# EasyEDA schematic RC-7606M-LED.json

## Sheets
1 Sheet_2: TITLE: Sheet_1; REV: 1.0; Date: 2022-10-01; Sheet: 1/1; Drawn By: kejinlu; Company: Your Company
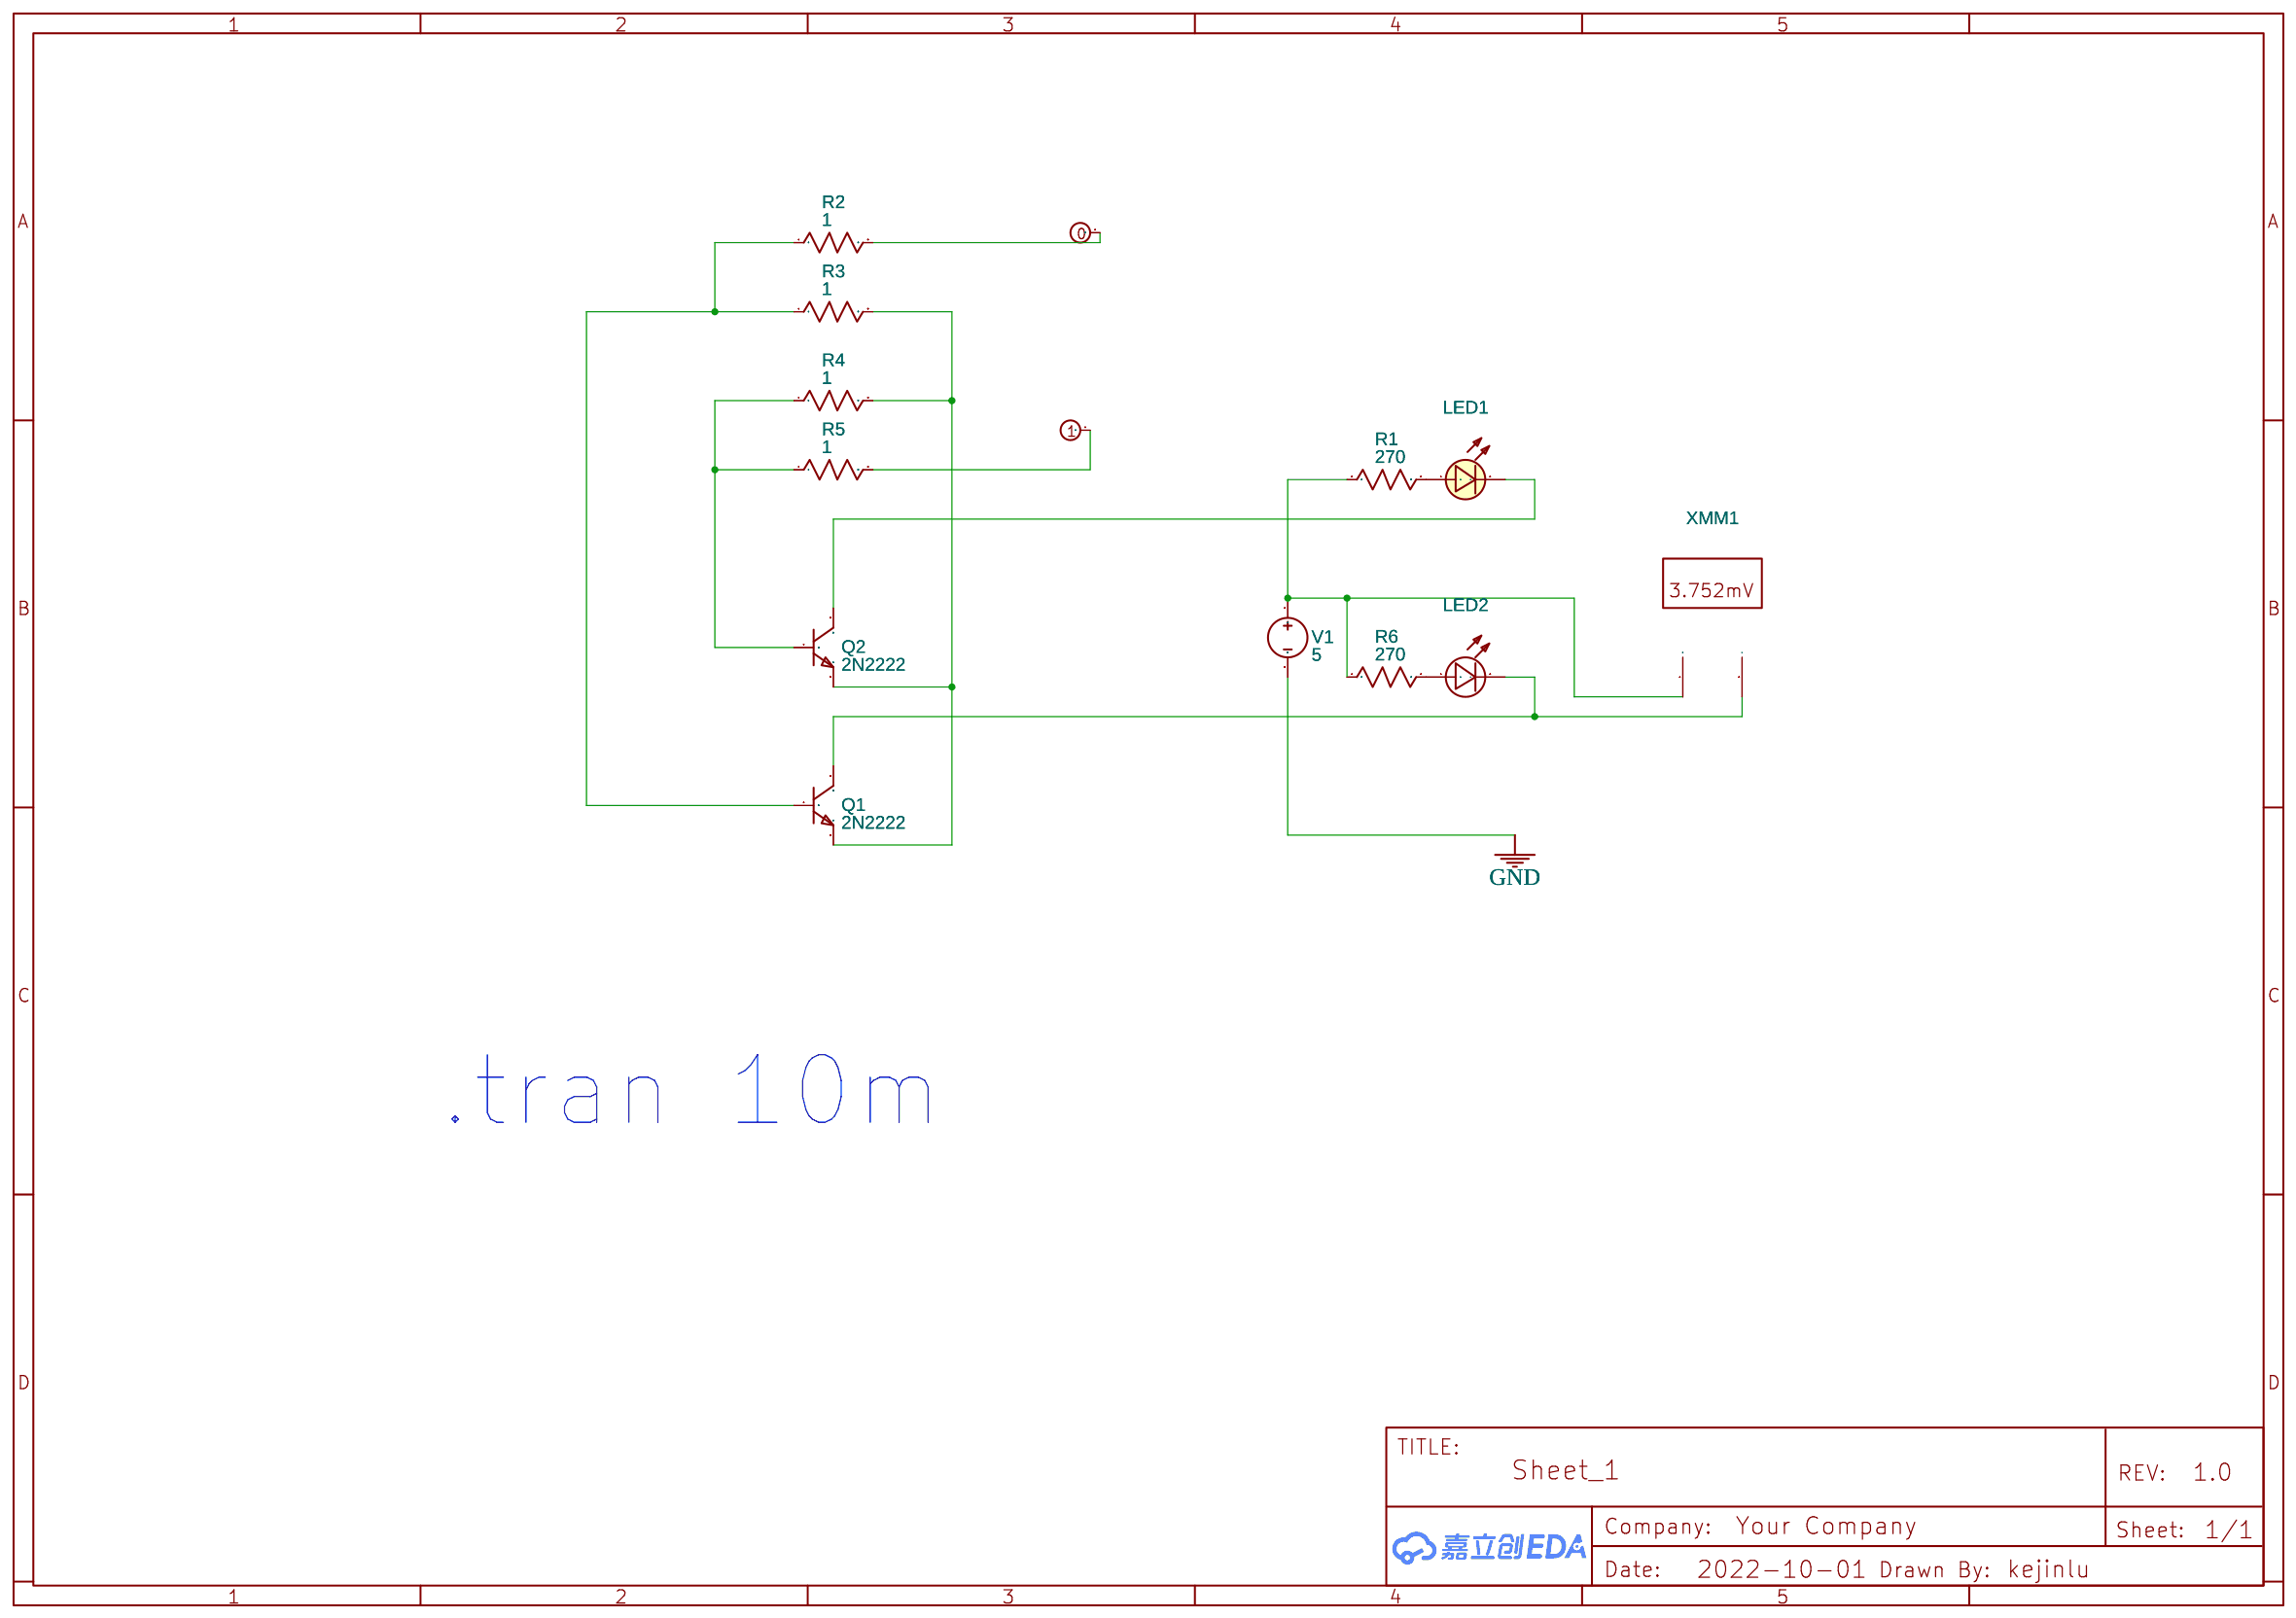
[diagram p0: Sheet_2]
2 Sheet_1: TITLE: Sheet_2; Date: 2022-10-02
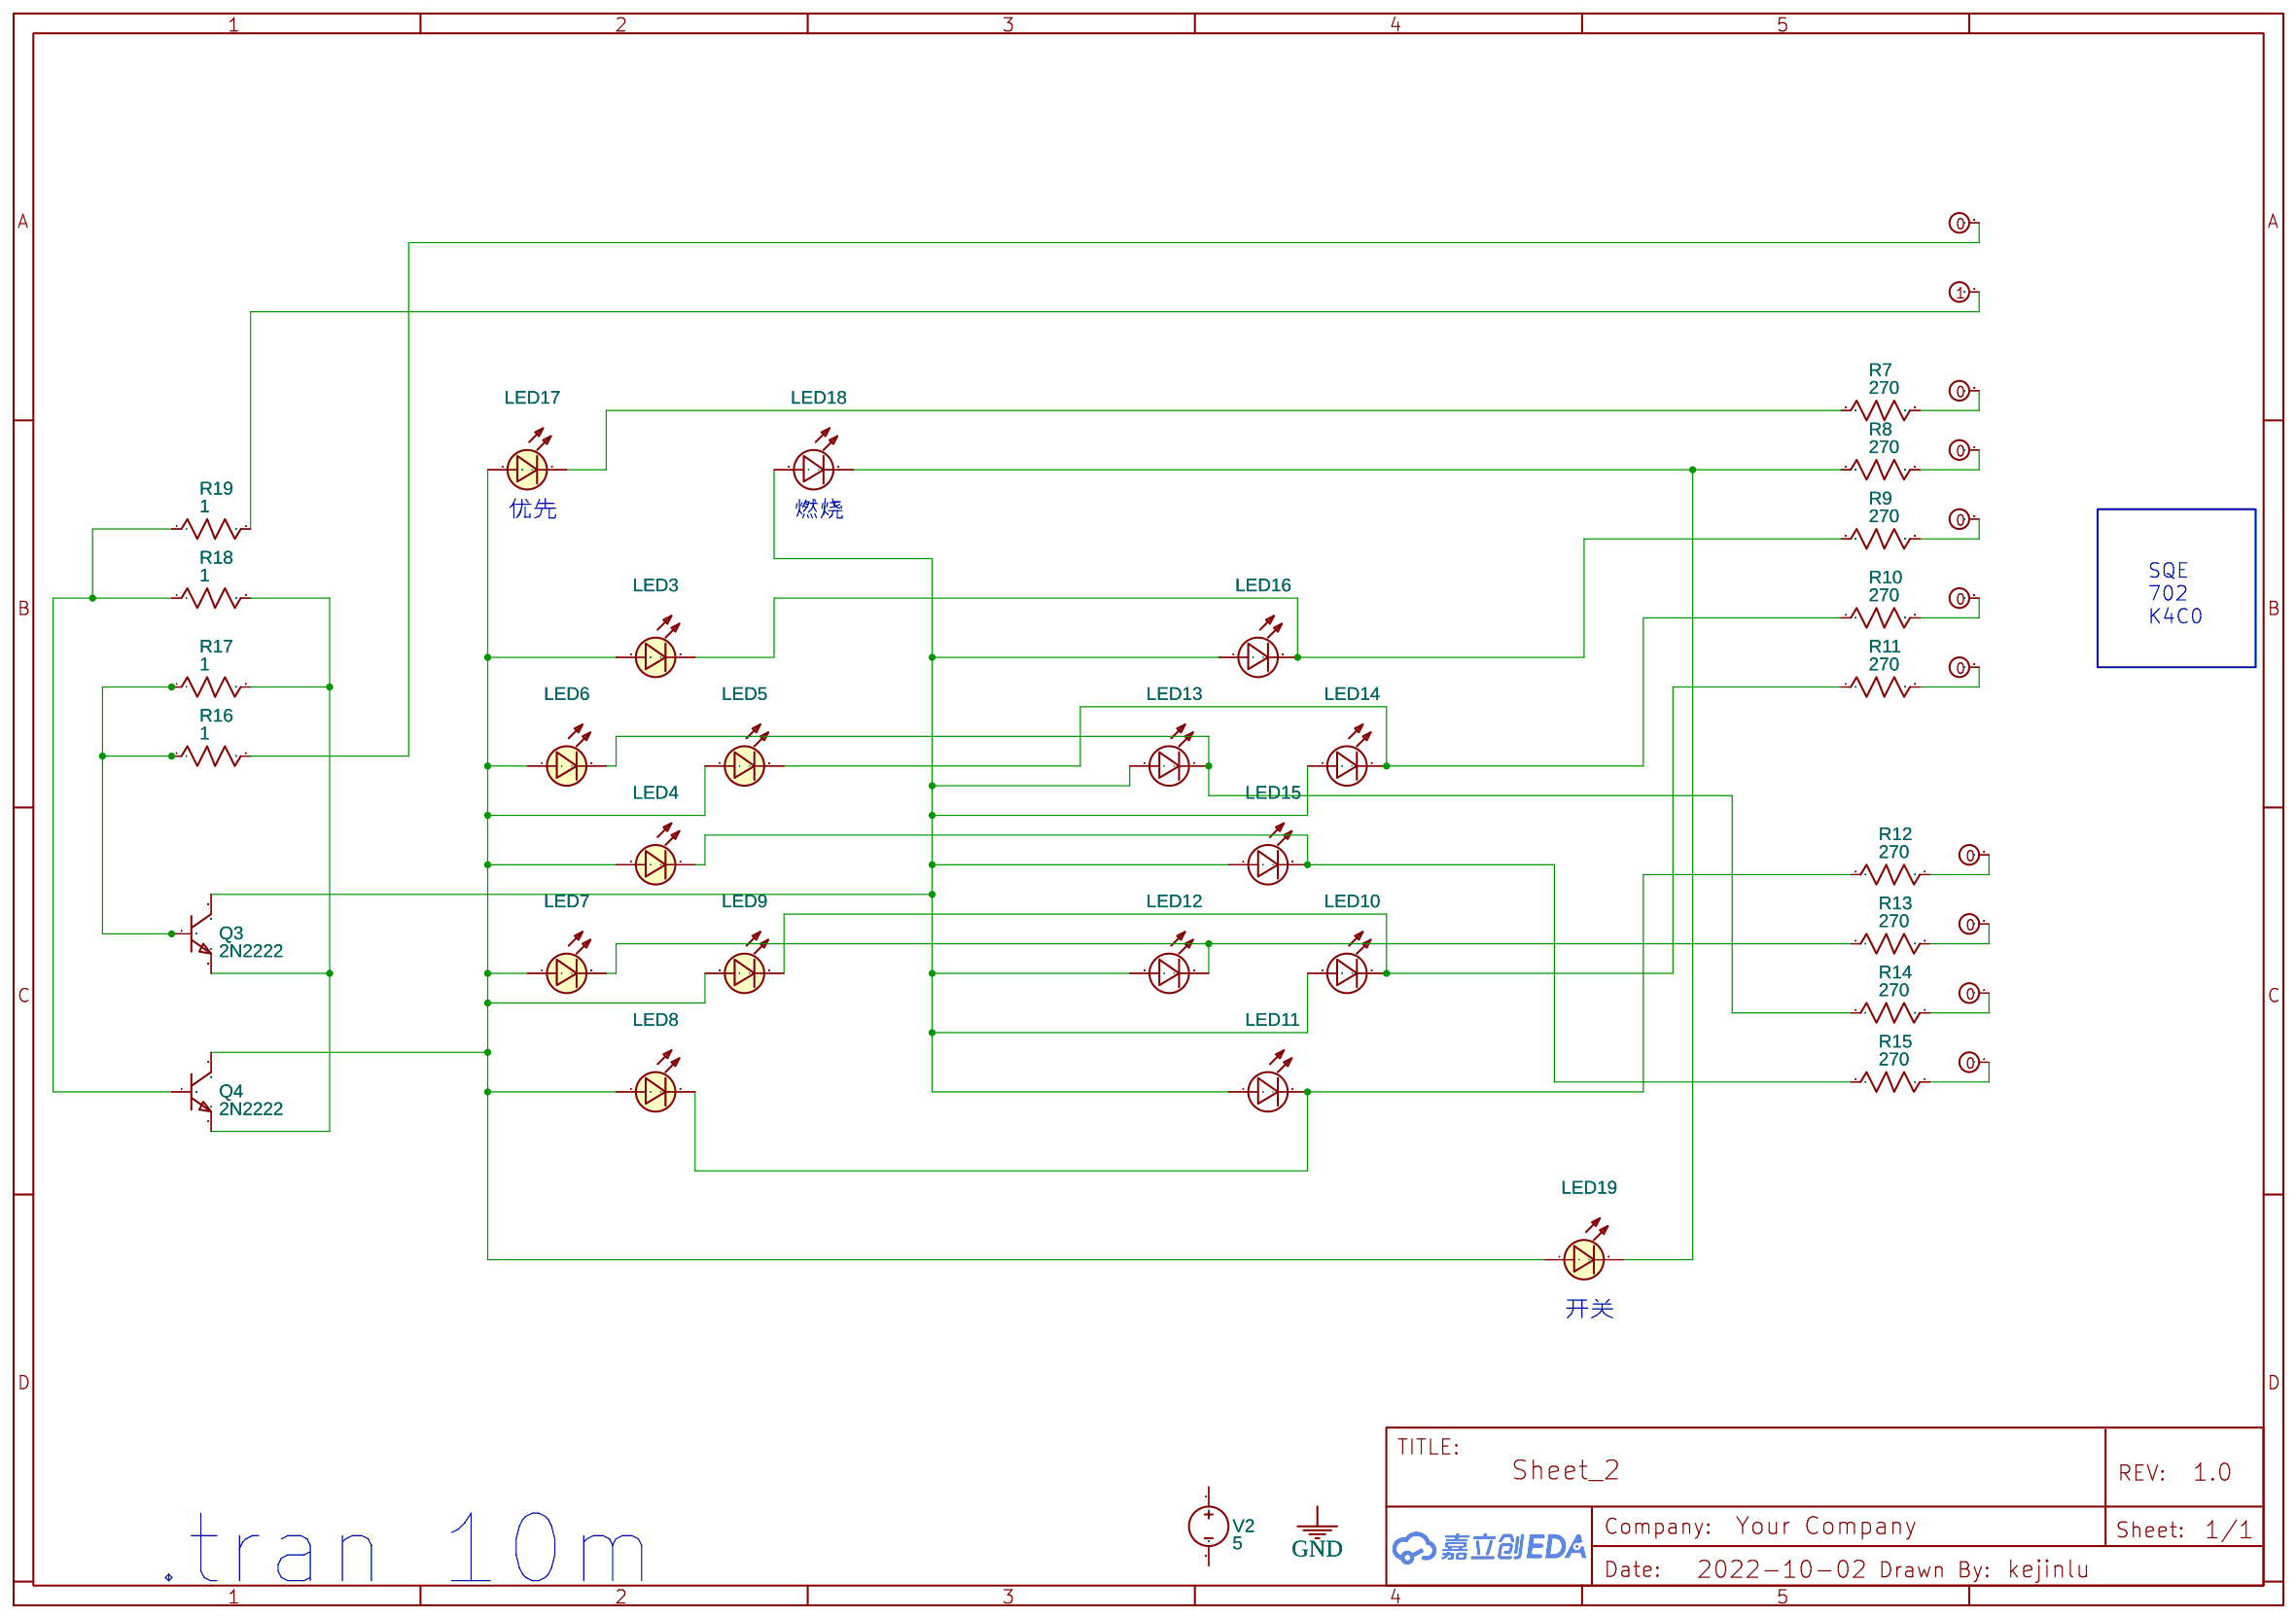
[diagram p1: Sheet_1]

## Parts
sheet Sheet_1
LED3  LED
LED4  LED
LED5  LED
LED6  LED
LED7  LED
LED8  LED
LED9  LED
LED10  LED
LED11  LED
LED12  LED
LED13  LED
LED14  LED
LED15  LED
LED16  LED
LED17  LED
LED18  LED
LED19  LED
Q3  2N2222
Q4  2N2222
R7  270  [AXIAL-0.3]
R8  270  [AXIAL-0.3]
R9  270  [AXIAL-0.3]
R10  270  [AXIAL-0.3]
R11  270  [AXIAL-0.3]
R12  270  [AXIAL-0.3]
R13  270  [AXIAL-0.3]
R14  270  [AXIAL-0.3]
R15  270  [AXIAL-0.3]
R16  1  [AXIAL-0.3]
R17  1  [AXIAL-0.3]
R18  1  [AXIAL-0.3]
R19  1  [AXIAL-0.3]
U3  Logicstate1
U4  Logicstate1
U5  Logicstate1
U6  Logicstate1
U7  Logicstate1
U8  Logicstate1
U9  Logicstate1
U10  Logicstate1
U11  Logicstate1
U12  Logicstate1
U13  Logicstate1
V2  5  [HDR1X2]
sheet Sheet_2
LED1  LED
LED2  LED
Q1  2N2222
Q2  2N2222
R1  270  [AXIAL-0.3]
R2  1  [AXIAL-0.3]
R3  1  [AXIAL-0.3]
R4  1  [AXIAL-0.3]
R5  1  [AXIAL-0.3]
R6  270  [AXIAL-0.3]
U1  Logicstate1
U2  Logicstate1
V1  5  [HDR1X2]
XMM1  Multimeter

## Library data of the parts
LED1-LED19 = LED: catid: 20; Contributor: 仿真库绘制; Color: Red; NameDisplay: 0
Q1-Q4 = 2N2222: Contributor: EasyEDA
R1-R19 = Resistor_US: Resistance: 1k; Contributor: EasyEDA; Supplier: YUJING
U1 U3 U5-U13 = LOGICSTATE: Contributor: EasyEDA; NameDisplay: 0; 值: 1; PreDisplay: 0; State: low
U2 U4 = LOGICSTATE: Contributor: EasyEDA; NameDisplay: 0; 值: 1; PreDisplay: 0; State: high
V1 V2 = VDC: Contributor: EasyEDA; sim: true
XMM1 = MULTIMETER: Supplier: LCSC; Multimeter Type: Volt; Power Type: AC; Voltmeter resistance: 10μ; Ammeter resistance: 1G; NameDisplay: 0; Contributor: EasyEDA; sim: true

## Nets
GND: V1.2
Net-(LED1-1): LED1.1(+) R1.2
Net-(LED1-2): LED1.2(-) Q2.3(C)
Net-(LED2-1): LED2.1(+) R6.2
Net-(LED2-2): LED2.2(-) Q1.3(C) XMM1.2(I)
Net-(LED3-1): LED3.1(+) LED4.1(+) LED5.1(+) LED6.1(+) LED7.1(+) LED8.1(+) LED9.1(+) LED17.1(+) LED19.1(+) Q4.3(C)
Net-(LED3-2): LED3.2(-) LED16.2(-) R9.1
Net-(LED4-2): LED4.2(-) LED15.2(-) R15.1
Net-(LED5-2): LED5.2(-) LED14.2(-) R10.1
Net-(LED6-2): LED6.2(-) LED13.2(-) R14.1
Net-(LED7-2): LED7.2(-) LED12.2(-) R13.1
Net-(LED8-2): LED8.2(-) LED11.2(-) R12.1
Net-(LED9-2): LED9.2(-) LED10.2(-) R11.1
Net-(LED10-1): LED10.1(+) LED11.1(+) LED12.1(+) LED13.1(+) LED14.1(+) LED15.1(+) LED16.1(+) LED18.1(+) Q3.3(C)
Net-(LED17-2): LED17.2(-) R7.1
Net-(LED18-2): LED18.2(-) LED19.2(-) R8.1
Net-(Q1-1): Q1.1(B) R2.1 R3.1
Net-(Q1-2): Q1.2(E) Q2.2(E) R3.2 R4.2
Net-(Q2-1): Q2.1(B) R4.1 R5.1
Net-(Q3-1): Q3.1(B) R16.1 R17.1
Net-(Q3-2): Q3.2(E) Q4.2(E) R17.2 R18.2
Net-(Q4-1): Q4.1(B) R18.1 R19.1
Net-(R1-1): R1.1 R6.1 V1.1 XMM1.1(+)
Net-(R2-2): R2.2 U1.1
Net-(R5-2): R5.2 U2.1
Net-(R7-2): R7.2 U5.1
Net-(R8-2): R8.2 U6.1
Net-(R9-2): R9.2 U7.1
Net-(R10-2): R10.2 U8.1
Net-(R11-2): R11.2 U9.1
Net-(R12-2): R12.2 U10.1
Net-(R13-2): R13.2 U11.1
Net-(R14-2): R14.2 U12.1
Net-(R15-2): R15.2 U13.1
Net-(R16-2): R16.2 U3.1
Net-(R19-2): R19.2 U4.1

Not connected (* = marked no-connect by the designer): V2 1 2

## Notes on the sheets
sheet 1
- .tran 10m
sheet 2
- 优先
- 燃烧
- SQE
  702
  K4C0
- 开关
- .tran 10m
